# Altium project Nowy.PrjPcb
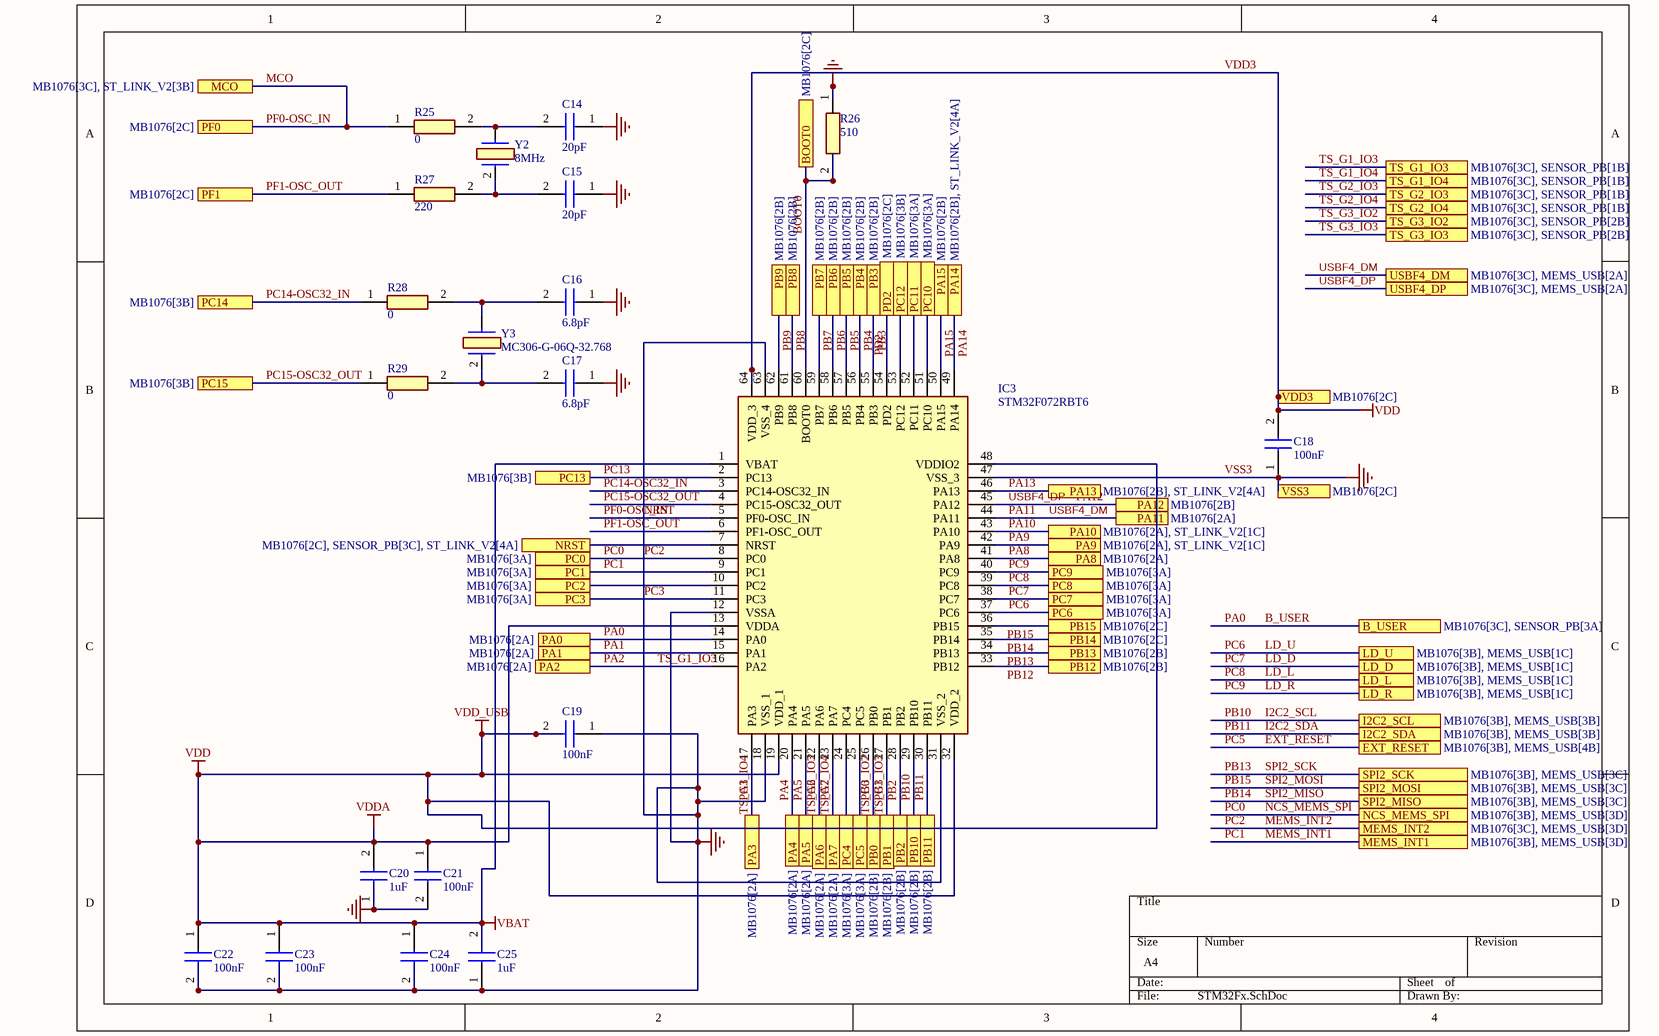
[diagram p0: STM32Fx.SchDoc]
2 sheets, 40 parts. Net scope: flat (ports and power ports of the same name join across sheets).
Board file: PCB_Nowy.PcbDoc
Sheets:
  STM32Fx.SchDoc
  MEMS_USB.SchDoc

## Sheet STM32Fx.SchDoc
size A4; SheetNumber: 3; SheetTotal: 5

### Parts
C14  20pF  [ECHU_J1_J2_17_21]
C15  20pF  [ECHU_J1_J2_17_21]
C16  6.8pF  [ECHU_J1_J2_17_21]
C17  6.8pF  [ECHU_J1_J2_17_21]
C18  100nF  [ECHU_J1_J2_17_21]
C19  100nF  [ECHU_J1_J2_17_21]
C20  1uF  [ECHU_J1_J2_17_21]
C21  100nF  [ECHU_J1_J2_17_21]
C22  100nF  [ECHU_J1_J2_17_21]
C23  100nF  [ECHU_J1_J2_17_21]
C24  100nF  [ECHU_J1_J2_17_21]
C25  1uF  [ECHU_J1_J2_17_21]
IC3  STM32F072RBT6  [QFP50P1200X1200X160-64N]
R25  0  [RESC2012X60N]
R26  510  [RESC2012X60N]
R27  220  [RESC2012X60N]
R28  0  [RESC2012X60N]
R29  0  [RESC2012X60N]
Y2  8MHz  [FOXSDLF08020]
Y3  MC306-G-06Q-32.768  [FOXSDLF08020]

### Ports
B_USER (see MB1076[3C], SENSOR_PB[3A]), BOOT0 (see MB1076[2C]), EXT_RESET (see MB1076[3B], MEMS_USB[4B]), I2C2_SCL (see MB1076[3B], MEMS_USB[3B]), I2C2_SDA (see MB1076[3B], MEMS_USB[3B]), LD_D (see MB1076[3B], MEMS_USB[1C]), LD_L (see MB1076[3B], MEMS_USB[1C]), LD_R (see MB1076[3B], MEMS_USB[1C]), LD_U (see MB1076[3B], MEMS_USB[1C]), MCO (see MB1076[3C], ST_LINK_V2[3B]), MEMS_INT1 (see MB1076[3B], MEMS_USB[3D]), MEMS_INT2 (see MB1076[3C], MEMS_USB[3D]), NCS_MEMS_SPI (see MB1076[3B], MEMS_USB[3D]), NRST (see MB1076[2C], SENSOR_PB[3C], ST_LINK_V2[4A]), PA0 (see MB1076[2A]), PA1 (see MB1076[2A]), PA2 (see MB1076[2A]), PA3 (see MB1076[2A]), PA4 (see MB1076[2A]), PA5 (see MB1076[2A]), PA6 (see MB1076[2A]), PA7 (see MB1076[2A]), PA8 (see MB1076[2A]), PA9 (see MB1076[2A], ST_LINK_V2[1C]), PA10 (see MB1076[2A], ST_LINK_V2[1C]), PA11 (see MB1076[2A]), PA12 (see MB1076[2B]), PA13 (see MB1076[2B], ST_LINK_V2[4A]), PA14 (see MB1076[2B], ST_LINK_V2[4A]), PA15 (see MB1076[2B]), PB0 (see MB1076[2B]), PB1 (see MB1076[2B]), PB2 (see MB1076[2B]), PB3 (see MB1076[2B]), PB4 (see MB1076[2B]), PB5 (see MB1076[2B]), PB6 (see MB1076[2B]), PB7 (see MB1076[2B]), PB8 (see MB1076[2B]), PB9 (see MB1076[2B]), PB10 (see MB1076[2B]), PB11 (see MB1076[2B]), PB12 (see MB1076[2B]), PB13 (see MB1076[2B]), PB14 (see MB1076[2C]), PB15 (see MB1076[2C]), PC0 (see MB1076[3A]), PC1 (see MB1076[3A]), PC2 (see MB1076[3A]), PC3 (see MB1076[3A]), PC4 (see MB1076[3A]), PC5 (see MB1076[3A]), PC6 (see MB1076[3A]), PC7 (see MB1076[3A]), PC8 (see MB1076[3A]), PC9 (see MB1076[3A]), PC10 (see MB1076[3A]), PC11 (see MB1076[3A]), PC12 (see MB1076[3B]), PC13 (see MB1076[3B]), PC14 (see MB1076[3B]), PC15 (see MB1076[3B]), PD2 (see MB1076[2C]), PF0 (see MB1076[2C]), PF1 (see MB1076[2C]), SPI2_MISO (see MB1076[3B], MEMS_USB[3C]), SPI2_MOSI (see MB1076[3B], MEMS_USB[3C]), SPI2_SCK (see MB1076[3B], MEMS_USB[3C]), TS_G1_IO3 (see MB1076[3C], SENSOR_PB[1B]), TS_G1_IO4 (see MB1076[3C], SENSOR_PB[1B]), TS_G2_IO3 (see MB1076[3C], SENSOR_PB[1B]), TS_G2_IO4 (see MB1076[3C], SENSOR_PB[1B]), TS_G3_IO2 (see MB1076[3C], SENSOR_PB[2B]), TS_G3_IO3 (see MB1076[3C], SENSOR_PB[2B]), USBF4_DM (see MB1076[3C], MEMS_USB[2A]), USBF4_DP (see MB1076[3C], MEMS_USB[2A]), VDD3 (see MB1076[2C]), VSS3 (see MB1076[2C])

### Nets
MCO: C14.1 C15.1 C16.1 C17.1 C18.1 C19.1 C20.1 C21.2 C22.2 C23.2 C24.2 C25.1 IC3.5(PF0-OSC_IN) IC3.8(PC0) IC3.11(PC3) IC3.12(VSSA) IC3.17(PA3) IC3.18(VSS_1) IC3.31(VSS_2) IC3.47(VSS_3) IC3.63(VSS_4) R25.1 R26.1 ; port PF0, port MCO, port PC0, port VSS3, port PA3, port PC3, port TS_G1_IO4, port NCS_MEMS_SPI, port MEMS_INT2  [also labelled GND, MEMS_INT2, NCS_MEMS_SPI, NRST, PA3, PC0, PC2, PC3, PF0-OSC_IN, TS_G1_IO4, VSS3]
VDD3: C18.2 C19.2 C20.2 C21.1 C22.1 C23.1 C24.1 C25.2 IC3.1(VBAT) IC3.13(VDDA) IC3.19(VDD_1) IC3.32(VDD_2) IC3.48(VDDIO2) IC3.64(VDD_3) ; port VDD3  [also labelled VBAT, VDD, VDD_USB, VDDA]
B_USER: IC3.14(PA0) ; port PA0, port B_USER  [also labelled PA0]
BOOT0: IC3.60(BOOT0) R26.2 ; port BOOT0
I2C2_SCL: IC3.29(PB10) ; port PB10, port I2C2_SCL  [also labelled PB10]
I2C2_SDA: IC3.30(PB11) ; port PB11, port I2C2_SDA  [also labelled PB11]
LD_D: IC3.38(PC7) ; port PC7, port LD_D  [also labelled PC7]
LD_L: IC3.39(PC8) ; port PC8, port LD_L  [also labelled PC8]
LD_R: IC3.40(PC9) ; port PC9, port LD_R  [also labelled PC9]
LD_U: IC3.37(PC6) ; port PC6, port LD_U  [also labelled PC6]
MEMS_INT1: IC3.9(PC1) ; port PC1, port MEMS_INT1  [also labelled PC1]
PA1: IC3.15(PA1) ; port PA1
PA2: IC3.16(PA2) ; port PA2, port TS_G1_IO3  [also labelled TS_G1_IO3]
PA4: IC3.20(PA4) ; port PA4
PA5: IC3.21(PA5) ; port PA5
PA6: IC3.22(PA6) ; port PA6, port TS_G2_IO3  [also labelled TS_G2_IO3]
PA7: IC3.23(PA7) ; port PA7, port TS_G2_IO4  [also labelled TS_G2_IO4]
PA8: IC3.41(PA8) ; port PA8
PA9: IC3.42(PA9) ; port PA9
PA10: IC3.43(PA10) ; port PA10
PA11: IC3.44(PA11) ; port PA11, port USBF4_DM  [also labelled USBF4_DM]
PA12: IC3.45(PA12) ; port PA12, port USBF4_DP  [also labelled USBF4_DP]
PA13: IC3.46(PA13) ; port PA13
PA14: IC3.49(PA14) ; port PA14
PA15: IC3.50(PA15) ; port PA15
PB0: IC3.26(PB0) ; port PB0, port TS_G3_IO2  [also labelled TS_G3_IO2]
PB1: IC3.27(PB1) ; port PB1, port TS_G3_IO3  [also labelled TS_G3_IO3]
PB2: IC3.28(PB2) ; port PB2
PB3: IC3.55(PB3) ; port PB3
PB4: IC3.56(PB4) ; port PB4
PB5: IC3.57(PB5) ; port PB5
PB6: IC3.58(PB6) ; port PB6
PB7: IC3.59(PB7) ; port PB7
PB8: IC3.61(PB8) ; port PB8
PB9: IC3.62(PB9) ; port PB9
PB12: IC3.33(PB12) ; port PB12
PB13: IC3.34(PB13) ; port PB13, port SPI2_SCK  [also labelled SPI2_SCK]
PB14: IC3.35(PB14) ; port PB14, port SPI2_MISO  [also labelled SPI2_MISO]
PB15: IC3.36(PB15) ; port PB15, port SPI2_MOSI  [also labelled SPI2_MOSI]
PC13: IC3.2(PC13) ; port PC13
PC14-OSC32_IN: IC3.3(PC14-OSC32_IN) R28.1 ; port PC14
PC15-OSC32_OUT: IC3.4(PC15-OSC32_OUT) R29.1 ; port PC15
PD2: IC3.54(PD2) ; port PD2
PF1-OSC_OUT: IC3.6(PF1-OSC_OUT) R27.1 ; port PF1
NetC14_2: C14.2 R25.2 Y2.?1
NetC15_2: C15.2 R27.2 Y2.2(CRYSTAL_2)
NetC16_2: C16.2 R28.2 Y3.?1
NetC17_2: C17.2 R29.2 Y3.2(CRYSTAL_2)
NetIC3_7: IC3.7(NRST) ; port NRST
NetIC3_10: IC3.10(PC2) ; port PC2
NetIC3_24: IC3.24(PC4) ; port PC4
NetIC3_25: IC3.25(PC5) ; port PC5
NetIC3_51: IC3.51(PC10) ; port PC10
NetIC3_52: IC3.52(PC11) ; port PC11
NetIC3_53: IC3.53(PC12) ; port PC12

### Library data of the parts
C14-C25 = ECH-U1H102GX5: Capacitor; Manufacturer_Name: Panasonic; Datasheet Link: http://industrial.panasonic.com/cdbs/www-data/pdf/RDI0000/ABD0000C173.pdf; Manufacturer_Part_Number: ECH-U1H102GX5; Mouser Part Number: 667-ECH-U1H102GX5; Mouser Price/Stock: https://www.mouser.co.uk/ProductDetail/Panasonic/ECH-U1H102GX5?qs=DWeLBnRir%2FIlo4Nc0F6AmQ%3D%3D; Arrow Part Number: ECH-U1H102GX5; Arrow Price/Stock: https://www.arrow.com/en/products/echu1h102gx5/panasonic?region=europe
IC3 = STM32F072RBT6: Integrated Circuit; Manufacturer_Name: STMicroelectronics; Datasheet Link: http://www.st.com/st-web-ui/static/active/en/resource/technical/document/datasheet/DM00090510.pdf; Height: 1.6mm; Manufacturer_Part_Number: STM32F072RBT6; Mouser Part Number: 511-STM32F072RBT6; Mouser Price/Stock: https://www.mouser.co.uk/ProductDetail/STMicroelectronics/STM32F072RBT6?qs=xf9JV0PLFEcuk6sTlnutaw%3D%3D; Arrow Part Number: STM32F072RBT6; Arrow Price/Stock: https://www.arrow.com/en/products/stm32f072rbt6/stmicroelectronics?region=nac
R25-R29 = RK73H2ATTD5111F: Resistor; Manufacturer_Name: KOA Speer; Datasheet Link: http://www.koaspeer.com/catimages/Products/RK73H/RK73H.pdf; Height: 0.6mm; Manufacturer_Part_Number: RK73H2ATTD5111F
Y2 Y3 = FOXSDLF_080-20_1: Crystal or Oscillator; Manufacturer_Name: Fox; Manufacturer_Part_Number: FOXSDLF/080-20; Datasheet Link: http://uk.rs-online.com/web/p/products/5476452; Height: 4.5mm; Mouser Part Number: 559-FOXSD080-20-LF; Mouser Price/Stock: https://www.mouser.co.uk/ProductDetail/Fox-Abracon/FOXSDLF-080-20?qs=mzRxyRlhVdu42DWWSpKTJw%3D%3D; Arrow Part Number: FOXSDLF/080-20; Arrow Price/Stock: https://www.arrow.com/en/products/foxsdlf080-20/fox-electronics

## Sheet MEMS_USB.SchDoc
size A4; SheetNumber: 4; SheetTotal: 5
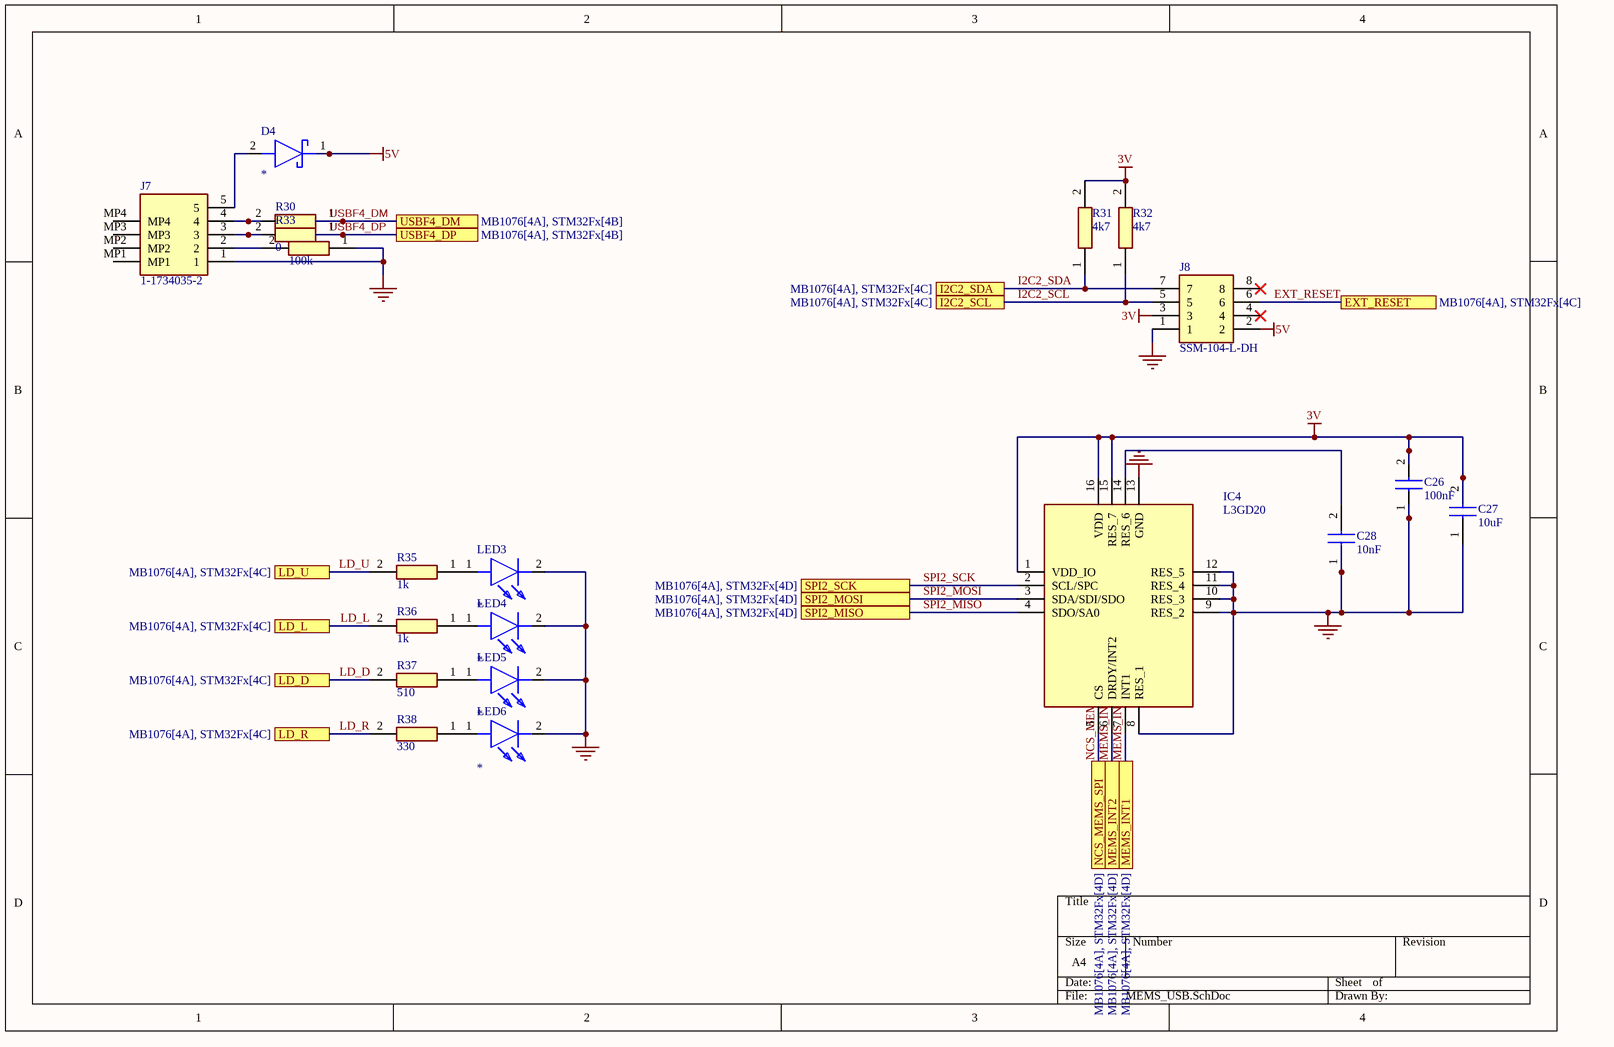
[diagram p1: MEMS_USB.SchDoc]

### Parts
C26  100nF  [ECHU_J1_J2_17_21]
C27  10uF  [ECHU_J1_J2_17_21]
C28  10nF  [ECHU_J1_J2_17_21]
D4  *  [SOD2513X117N]
IC4  L3GD20  [QFN65P400X400X100-16N]
J7  1-1734035-2  [117340352]
J8  SSM-104-L-DH  [SSM-104-XXX-DH]
LED3  *  [19213R6CAP1Q2B3T]
LED4  *  [19213R6CAP1Q2B3T]
LED5  *  [19213R6CAP1Q2B3T]
LED6  *  [19213R6CAP1Q2B3T]
R30  0  [RESC2012X60N]
R31  4k7  [RESC2012X60N]
R32  4k7  [RESC2012X60N]
R33  0  [RESC2012X60N]
R34  100k  [RESC2012X60N]
R35  1k  [RESC2012X60N]
R36  1k  [RESC2012X60N]
R37  510  [RESC2012X60N]
R38  330  [RESC2012X60N]

### Ports
EXT_RESET (see MB1076[4A], STM32Fx[4C]), I2C2_SCL (see MB1076[4A], STM32Fx[4C]), I2C2_SDA (see MB1076[4A], STM32Fx[4C]), LD_D (see MB1076[4A], STM32Fx[4C]), LD_L (see MB1076[4A], STM32Fx[4C]), LD_R (see MB1076[4A], STM32Fx[4C]), LD_U (see MB1076[4A], STM32Fx[4C]), MEMS_INT1 (see MB1076[4A], STM32Fx[4D]), MEMS_INT2 (see MB1076[4A], STM32Fx[4D]), NCS_MEMS_SPI (see MB1076[4A], STM32Fx[4D]), SPI2_MISO (see MB1076[4A], STM32Fx[4D]), SPI2_MOSI (see MB1076[4A], STM32Fx[4D]), SPI2_SCK (see MB1076[4A], STM32Fx[4D]), USBF4_DM (see MB1076[4A], STM32Fx[4B]), USBF4_DP (see MB1076[4A], STM32Fx[4B])

### Nets
3V: C26.2 C27.2 IC4.1(VDD_IO) IC4.15(RES_7) IC4.16(VDD) J8.3 R31.2 R32.2
5V: D4.1(K) J8.2
GND: C26.1 C27.1 C28.1 IC4.5(CS) IC4.6(DRDY/INT2) IC4.8(RES_1) IC4.9(RES_2) IC4.10(RES_3) IC4.11(RES_4) IC4.12(RES_5) IC4.13(GND) J7.1 J8.1 LED3.2(K) LED4.2(K) LED5.2(K) LED6.2(K) R34.1 ; port NCS_MEMS_SPI, port MEMS_INT2  [also labelled MEMS_INT2, NCS_MEMS_SPI]  [project net MCO]
EXT_RESET: J8.6 ; port EXT_RESET
I2C2_SCL: J8.5 R32.1 ; port I2C2_SCL
I2C2_SDA: J8.7 R31.1 ; port I2C2_SDA
LD_D: R37.2 ; port LD_D
LD_L: R36.2 ; port LD_L
LD_R: R38.2 ; port LD_R
LD_U: R35.2 ; port LD_U
MEMS_INT1: IC4.7(INT1) ; port MEMS_INT1
SPI2_MISO: IC4.4(SDO/SA0) ; port SPI2_MISO  [project net PB14]
SPI2_MOSI: IC4.3(SDA/SDI/SDO) ; port SPI2_MOSI  [project net PB15]
SPI2_SCK: IC4.2(SCL/SPC) ; port SPI2_SCK  [project net PB13]
USBF4_DM: R30.1 ; port USBF4_DM  [project net PA11]
USBF4_DP: R33.1 ; port USBF4_DP  [project net PA12]
NetC28_2: C28.2 IC4.14(RES_6)
NetD4_2: D4.2(A) J7.5
NetJ7_2: J7.2 R34.2
NetJ7_3: J7.3 R33.2
NetJ7_4: J7.4 R30.2
NetLED3_1: LED3.1(A) R35.1
NetLED4_1: LED4.1(A) R36.1
NetLED5_1: LED5.1(A) R37.1
NetLED6_1: LED6.1(A) R38.1

Not connected (* = marked no-connect by the designer): J7 MP1 MP2 MP3 MP4; J8 4* 8*

### Library data of the parts
C26-C28 = ECH-U1H102GX5: Capacitor; Manufacturer_Name: Panasonic; Datasheet Link: http://industrial.panasonic.com/cdbs/www-data/pdf/RDI0000/ABD0000C173.pdf; Manufacturer_Part_Number: ECH-U1H102GX5; Mouser Part Number: 667-ECH-U1H102GX5; Mouser Price/Stock: https://www.mouser.co.uk/ProductDetail/Panasonic/ECH-U1H102GX5?qs=DWeLBnRir%2FIlo4Nc0F6AmQ%3D%3D; Arrow Part Number: ECH-U1H102GX5; Arrow Price/Stock: https://www.arrow.com/en/products/echu1h102gx5/panasonic?region=europe
D4 = BAT60JFILM: Schottky Diode; Manufacturer_Name: STMicroelectronics; Datasheet Link: https://www.mouser.jp/datasheet/2/389/cd00001944-1795661.pdf; Height: 1.17mm; Manufacturer_Part_Number: BAT60JFILM; Mouser Part Number: 511-BAT60JFILM; Mouser Price/Stock: https://www.mouser.co.uk/ProductDetail/STMicroelectronics/BAT60JFILM?qs=GnFZssByvVVVnMaukcyLZg%3D%3D; Arrow Part Number: BAT60JFILM; Arrow Price/Stock: https://www.arrow.com/en/products/bat60jfilm/stmicroelectronics?region=nac
IC4 = L3GD20: Integrated Circuit; Manufacturer_Name: STMicroelectronics; Datasheet Link: http://www.mouser.com/datasheet/2/389/l3gd20-954745.pdf; Height: 1mm; Manufacturer_Part_Number: L3GD20; Mouser Part Number: 511-L3GD20; Mouser Price/Stock: https://www.mouser.co.uk/ProductDetail/STMicroelectronics/L3GD20?qs=LYO3r17CQdPwKetw3Km8nw%3D%3D
J7 = 1-1734035-2: Connector; Manufacturer_Name: TE Connectivity; Datasheet Link: https://www.arrow.com/en/products/1-1734035-2/te-connectivity; Height: 4.08mm; Manufacturer_Part_Number: 1-1734035-2; Mouser Part Number: 571-1-1734035-2; Mouser Price/Stock: https://www.mouser.co.uk/ProductDetail/TE-Connectivity/1-1734035-2?qs=vnwGVgFuQiZQrcvyrtufjA%3D%3D; Arrow Part Number: 1-1734035-2; Arrow Price/Stock: https://www.arrow.com/en/products/1-1734035-2/te-connectivity?region=nac
J8 = SSM-104-L-DH: Connector; Manufacturer_Name: SAMTEC; Datasheet Link: http://suddendocs.samtec.com/prints/ssm-1xx-xxx-xx-xx-xx-x-xx-xx-mkt.pdf; Manufacturer_Part_Number: SSM-104-L-DH; Mouser Part Number: 200-SSM104LDH; Mouser Price/Stock: https://www.mouser.co.uk/ProductDetail/Samtec/SSM-104-L-DH?qs=rU5fayqh%252BE2%252BZRQJ2nT%2FIw%3D%3D; Arrow Part Number: SSM-104-L-DH; Arrow Price/Stock: https://www.arrow.com/en/products/ssm-104-l-dh/samtec?utm_currency=USD&region=nac
LED3-LED6 = 19-213-R6C-AP1Q2B-3T: LED; Manufacturer_Name: Everlight; Datasheet Link: https://www.arrow.com/en/products/19-213-r6c-ap1q2b-3t/everlight-electronics; Height: 0.7mm; Manufacturer_Part_Number: 19-213-R6C-AP1Q2B-3T; Arrow Part Number: 19-213-R6C-AP1Q2B-3T; Arrow Price/Stock: https://www.arrow.com/en/products/19-213-r6c-ap1q2b-3t/everlight-electronics?region=nac
R30-R38 = RK73H2ATTD5111F: Resistor; Manufacturer_Name: KOA Speer; Datasheet Link: http://www.koaspeer.com/catimages/Products/RK73H/RK73H.pdf; Height: 0.6mm; Manufacturer_Part_Number: RK73H2ATTD5111F

## Nets that join several sheets
MCO: STM32Fx (23 pins), MEMS_USB (18 pins)
I2C2_SCL: STM32Fx (IC3.29), MEMS_USB (J8.5 R32.1)
I2C2_SDA: STM32Fx (IC3.30), MEMS_USB (J8.7 R31.1)
LD_D: STM32Fx (IC3.38), MEMS_USB (R37.2)
LD_L: STM32Fx (IC3.39), MEMS_USB (R36.2)
LD_R: STM32Fx (IC3.40), MEMS_USB (R38.2)
LD_U: STM32Fx (IC3.37), MEMS_USB (R35.2)
MEMS_INT1: STM32Fx (IC3.9), MEMS_USB (IC4.7)
PA11: STM32Fx (IC3.44), MEMS_USB (R30.1)
PA12: STM32Fx (IC3.45), MEMS_USB (R33.1)
PB13: STM32Fx (IC3.34), MEMS_USB (IC4.2)
PB14: STM32Fx (IC3.35), MEMS_USB (IC4.4)
PB15: STM32Fx (IC3.36), MEMS_USB (IC4.3)